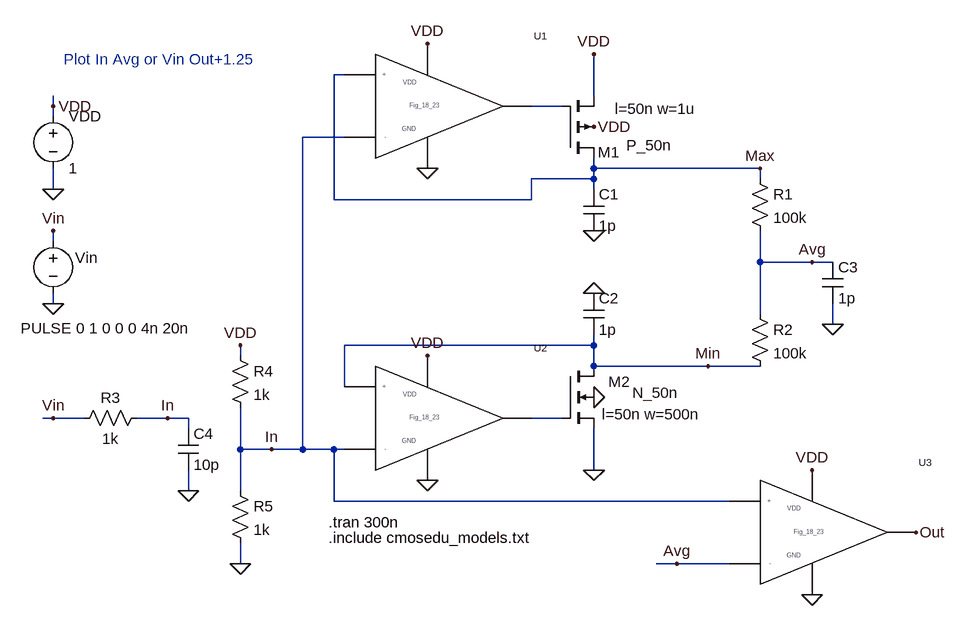
[diagram p0: schematic Fig18_31.asc]
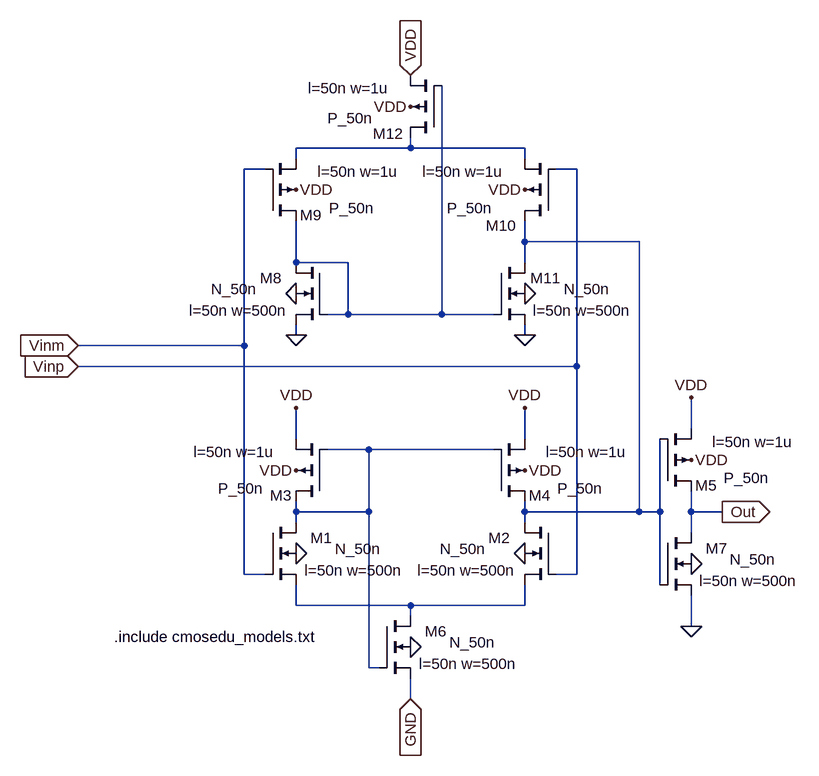
[diagram p1: sub-circuit fig_18_23.asc]
Fig18_31.asc, the LTspice schematic file:
Version 4
SHEET 1 1764 680
WIRE 672 -928 656 -928
WIRE 1056 -896 1056 -960
WIRE 224 -880 224 -896
WIRE 1008 -880 960 -880
WIRE 224 -864 224 -880
WIRE 672 -832 608 -832
WIRE 1056 -784 1056 -800
WIRE 1312 -784 1056 -784
WIRE 1056 -768 1056 -784
WIRE 1056 -768 960 -768
WIRE 1312 -768 1312 -784
WIRE 224 -752 224 -784
WIRE 1056 -752 1056 -768
WIRE 656 -736 656 -928
WIRE 960 -736 960 -768
WIRE 960 -736 656 -736
WIRE 224 -672 224 -688
WIRE 1312 -640 1312 -688
WIRE 1392 -640 1312 -640
WIRE 1424 -640 1392 -640
WIRE 224 -576 224 -592
WIRE 1312 -560 1312 -640
WIRE 1424 -544 1424 -576
WIRE 1056 -512 1056 -528
WIRE 1056 -512 672 -512
WIRE 512 -496 512 -512
WIRE 1056 -480 1056 -512
WIRE 1232 -480 1056 -480
WIRE 1312 -480 1232 -480
WIRE 672 -448 672 -512
WIRE 224 -400 208 -400
WIRE 272 -400 224 -400
WIRE 400 -400 352 -400
WIRE 432 -400 400 -400
WIRE 1008 -400 960 -400
WIRE 432 -384 432 -400
WIRE 512 -352 512 -416
WIRE 560 -352 512 -352
WIRE 608 -352 608 -832
WIRE 608 -352 560 -352
WIRE 656 -352 608 -352
WIRE 672 -352 656 -352
WIRE 1056 -320 1056 -384
WIRE 432 -288 432 -320
WIRE 512 -288 512 -352
WIRE 656 -272 656 -352
WIRE 1264 -272 656 -272
WIRE 512 -176 512 -208
WIRE 1184 -176 1152 -176
WIRE 1264 -176 1184 -176
FLAG 224 -576 0
FLAG 224 -688 Vin
FLAG 224 -752 0
FLAG 224 -880 VDD
FLAG 800 -784 0
FLAG 800 -304 0
FLAG 800 -976 VDD
FLAG 800 -496 VDD
FLAG 560 -352 In
FLAG 1056 -848 VDD
FLAG 1056 -432 0
FLAG 1424 -544 0
FLAG 1056 -688 0
FLAG 1056 -592 0
FLAG 1056 -960 VDD
FLAG 1056 -320 0
FLAG 1392 -640 Avg
FLAG 1312 -784 Max
FLAG 1232 -480 Min
FLAG 1392 -320 VDD
FLAG 1392 -128 0
FLAG 1184 -176 Avg
FLAG 1552 -224 Out
FLAG 432 -288 0
FLAG 400 -400 In
FLAG 224 -400 Vin
FLAG 512 -512 VDD
FLAG 512 -176 0
SYMBOL voltage 224 -688 R0
WINDOW 0 34 41 Left 2
WINDOW 3 -50 150 Left 2
WINDOW 123 0 0 Left 2
WINDOW 39 0 0 Left 2
SYMATTR InstName Vin
SYMATTR Value PULSE 0 1 0 0 0 4n 20n
SYMBOL voltage 224 -880 R0
WINDOW 123 0 0 Left 2
WINDOW 39 0 0 Left 2
SYMATTR InstName VDD
SYMATTR Value 1
SYMBOL Fig_18_23 720 -880 R0
SYMATTR InstName U1
SYMBOL Fig_18_23 720 -400 R0
SYMATTR InstName U2
SYMBOL Fig_18_23 1312 -224 R0
SYMATTR InstName U3
SYMBOL pmos4 1008 -800 M180
WINDOW 0 88 9 Right 2
WINDOW 3 168 20 Right 2
WINDOW 123 206 76 Right 2
SYMATTR InstName M1
SYMATTR Value P_50n
SYMATTR Value2 l=50n w=1u
SYMBOL nmos4 1008 -480 R0
WINDOW 0 104 24 Right 2
WINDOW 3 179 41 Right 2
WINDOW 123 213 74 Right 2
SYMATTR InstName M2
SYMATTR Value N_50n
SYMATTR Value2 l=50n w=500n
SYMBOL cap 1040 -752 R0
SYMATTR InstName C1
SYMATTR Value 1p
SYMBOL cap 1040 -592 R0
SYMATTR InstName C2
SYMATTR Value 1p
SYMBOL cap 1408 -640 R0
SYMATTR InstName C3
SYMATTR Value 1p
SYMBOL res 1296 -784 R0
SYMATTR InstName R1
SYMATTR Value 100k
SYMBOL res 1296 -576 R0
SYMATTR InstName R2
SYMATTR Value 100k
SYMBOL res 256 -384 R270
WINDOW 0 32 56 VTop 2
WINDOW 3 0 56 VBottom 2
SYMATTR InstName R3
SYMATTR Value 1k
SYMBOL cap 416 -384 R0
SYMATTR InstName C4
SYMATTR Value 10p
SYMBOL res 496 -512 R0
SYMATTR InstName R4
SYMATTR Value 1k
SYMBOL res 496 -304 R0
SYMATTR InstName R5
SYMATTR Value 1k
TEXT 648 -240 Left 2 !.tran 300n
TEXT 648 -216 Left 2 !.include cmosedu_models.txt
TEXT 240 -952 Left 2 ;Plot In Avg or Vin Out+1.25

fig_18_23.asc, the sub-circuit schematic file:
Version 4
SHEET 1 1496 680
WIRE 768 -1072 768 -1088
WIRE 768 -1072 592 -1072
WIRE 944 -1072 768 -1072
WIRE 592 -1056 592 -1072
WIRE 944 -1056 944 -1072
WIRE 544 -1040 512 -1040
WIRE 1024 -1040 992 -1040
WIRE 944 -928 944 -960
WIRE 1120 -928 944 -928
WIRE 592 -896 592 -960
WIRE 672 -896 592 -896
WIRE 944 -896 944 -928
WIRE 672 -816 672 -896
WIRE 672 -816 640 -816
WIRE 816 -816 816 -1168
WIRE 816 -816 672 -816
WIRE 896 -816 816 -816
WIRE 592 -784 592 -800
WIRE 944 -784 944 -800
WIRE 512 -768 512 -1040
WIRE 512 -768 256 -768
WIRE 1024 -736 1024 -1040
WIRE 1024 -736 256 -736
WIRE 1200 -640 1200 -688
WIRE 592 -624 592 -672
WIRE 944 -624 944 -672
WIRE 704 -608 640 -608
WIRE 896 -608 704 -608
WIRE 592 -512 592 -528
WIRE 704 -512 704 -608
WIRE 704 -512 592 -512
WIRE 944 -512 944 -528
WIRE 1120 -512 1120 -928
WIRE 1120 -512 944 -512
WIRE 1152 -512 1152 -624
WIRE 1152 -512 1120 -512
WIRE 1200 -512 1200 -544
WIRE 1248 -512 1200 -512
WIRE 592 -496 592 -512
WIRE 944 -496 944 -512
WIRE 1200 -480 1200 -512
WIRE 512 -416 512 -768
WIRE 544 -416 512 -416
WIRE 1024 -416 1024 -736
WIRE 1024 -416 992 -416
WIRE 1152 -400 1152 -512
WIRE 592 -368 592 -400
WIRE 768 -368 592 -368
WIRE 944 -368 944 -400
WIRE 944 -368 768 -368
WIRE 768 -352 768 -368
WIRE 1200 -336 1200 -384
WIRE 704 -272 704 -512
WIRE 720 -272 704 -272
WIRE 768 -224 768 -256
FLAG 592 -448 0
FLAG 592 -576 VDD
FLAG 592 -672 VDD
FLAG 944 -576 VDD
FLAG 944 -448 0
FLAG 944 -672 VDD
FLAG 768 -304 0
FLAG 1200 -592 VDD
FLAG 1200 -688 VDD
FLAG 1200 -432 0
FLAG 1200 -336 0
FLAG 592 -848 0
FLAG 592 -1008 VDD
FLAG 944 -1008 VDD
FLAG 944 -848 0
FLAG 768 -1136 VDD
FLAG 592 -784 0
FLAG 944 -784 0
FLAG 768 -1184 VDD
IOPIN 768 -1184 In
FLAG 768 -224 GND
IOPIN 768 -224 In
FLAG 1248 -512 Out
IOPIN 1248 -512 Out
FLAG 256 -768 Vinm
IOPIN 256 -768 In
FLAG 256 -736 Vinp
IOPIN 256 -736 In
SYMBOL nmos4 544 -496 R0
WINDOW 0 104 24 Right 2
WINDOW 3 179 41 Right 2
WINDOW 123 213 74 Right 2
SYMATTR InstName M1
SYMATTR Value N_50n
SYMATTR Value2 l=50n w=500n
SYMBOL pmos4 640 -528 R180
WINDOW 0 88 9 Right 2
WINDOW 3 168 20 Right 2
WINDOW 123 206 76 Right 2
SYMATTR InstName M3
SYMATTR Value P_50n
SYMATTR Value2 l=50n w=1u
SYMBOL pmos4 896 -528 M180
WINDOW 0 88 9 Right 2
WINDOW 3 168 20 Right 2
WINDOW 123 206 76 Right 2
SYMATTR InstName M4
SYMATTR Value P_50n
SYMATTR Value2 l=50n w=1u
SYMBOL nmos4 992 -496 M0
WINDOW 0 104 24 Right 2
WINDOW 3 179 41 Right 2
WINDOW 123 213 74 Right 2
SYMATTR InstName M2
SYMATTR Value N_50n
SYMATTR Value2 l=50n w=500n
SYMBOL nmos4 720 -352 R0
WINDOW 0 104 24 Right 2
WINDOW 3 179 41 Right 2
WINDOW 123 213 74 Right 2
SYMATTR InstName M6
SYMATTR Value N_50n
SYMATTR Value2 l=50n w=500n
SYMBOL pmos4 1152 -544 M180
WINDOW 0 88 9 Right 2
WINDOW 3 168 20 Right 2
WINDOW 123 206 76 Right 2
SYMATTR InstName M5
SYMATTR Value P_50n
SYMATTR Value2 l=50n w=1u
SYMBOL nmos4 1152 -480 R0
WINDOW 0 104 24 Right 2
WINDOW 3 179 41 Right 2
WINDOW 123 213 74 Right 2
SYMATTR InstName M7
SYMATTR Value N_50n
SYMATTR Value2 l=50n w=500n
SYMBOL nmos4 640 -896 M0
WINDOW 0 104 24 Right 2
WINDOW 3 179 41 Right 2
WINDOW 123 213 74 Right 2
SYMATTR InstName M8
SYMATTR Value N_50n
SYMATTR Value2 l=50n w=500n
SYMBOL pmos4 544 -960 M180
WINDOW 0 88 9 Right 2
WINDOW 3 168 20 Right 2
WINDOW 123 206 76 Right 2
SYMATTR InstName M9
SYMATTR Value P_50n
SYMATTR Value2 l=50n w=1u
SYMBOL pmos4 992 -960 R180
WINDOW 0 108 -7 Right 2
WINDOW 3 168 20 Right 2
WINDOW 123 206 76 Right 2
SYMATTR InstName M10
SYMATTR Value P_50n
SYMATTR Value2 l=50n w=1u
SYMBOL nmos4 896 -896 R0
WINDOW 0 104 24 Right 2
WINDOW 3 179 41 Right 2
WINDOW 123 213 74 Right 2
SYMATTR InstName M11
SYMATTR Value N_50n
SYMATTR Value2 l=50n w=500n
SYMBOL pmos4 816 -1088 R180
WINDOW 0 106 6 Right 2
WINDOW 3 176 30 Right 2
WINDOW 123 206 76 Right 2
SYMATTR InstName M12
SYMATTR Value P_50n
SYMATTR Value2 l=50n w=1u
TEXT 312 -320 Left 2 !.include cmosedu_models.txt

The netlist it stands for:
* Fig18_31.asc
Vin Vin 0 PULSE 0 1 0 0 0 4n 20n
VDD VDD 0 1
XU1 Max In N001 VDD 0 fig_18_23
XU2 Min In N002 VDD 0 fig_18_23
XU3 In Avg Out VDD 0 fig_18_23
M1 Max N001 VDD VDD P_50n l=50n w=1u
M2 Min N002 0 0 N_50n l=50n w=500n
C1 Max 0 1p
C2 0 Min 1p
C3 Avg 0 1p
R1 Max Avg 100k
R2 Avg Min 100k
R3 Vin In 1k
C4 In 0 10p
R4 VDD In 1k
R5 In 0 1k

* block symbol definitions
.subckt fig_18_23 Vinp Vinm Out VDD GND
M1 N004 Vinm N005 0 N_50n l=50n w=500n
M3 N004 N004 VDD VDD P_50n l=50n w=1u
M4 N002 N004 VDD VDD P_50n l=50n w=1u
M2 N002 Vinp N005 0 N_50n l=50n w=500n
M6 N005 N004 GND 0 N_50n l=50n w=500n
M5 Out N002 VDD VDD P_50n l=50n w=1u
M7 Out N002 0 0 N_50n l=50n w=500n
M8 N003 N003 0 0 N_50n l=50n w=500n
M9 N003 Vinm N001 VDD P_50n l=50n w=1u
M10 N002 Vinp N001 VDD P_50n l=50n w=1u
M11 N002 N003 0 0 N_50n l=50n w=500n
M12 N001 N003 VDD VDD P_50n l=50n w=1u
.include cmosedu_models.txt
.ends fig_18_23

.model NMOS NMOS
.model PMOS PMOS
.lib standard.mos
.tran 300n
.include cmosedu_models.txt
* Plot In Avg or Vin Out+1.25
.backanno
.end